# Altium schematic sheet [5] Resolver.SchDoc
size A4
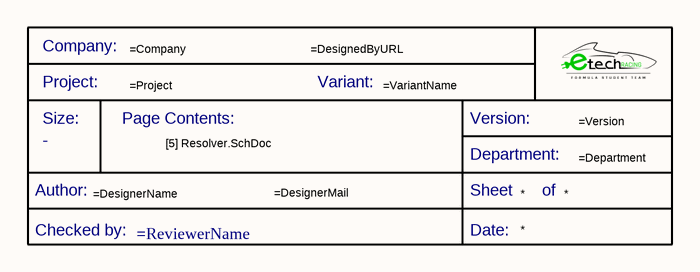
[diagram p0: [5] Resolver.SchDoc]

## Parts
*?  Title Block_template  (value not drawn)  (graphical)

## Notes on the sheet
- (in symbol Title Block_template) Company:; Project:; Variant:; Size:; Page Contents:; Version:; Department:; Author:; Sheet; of; Checked by:; Date:

## Library data of the parts
*? = Title Block_template: Standard Title Block; .Creator: GP; Category: Title Block; .PCBcheck: GP; .SCHcheck: GP; Checked by:: =ReviewerName; Size: -